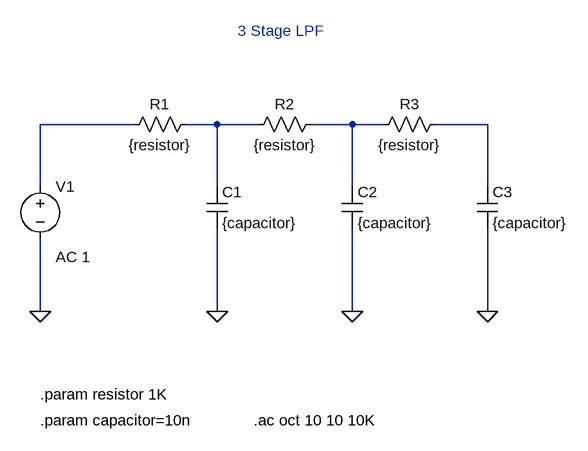
[diagram p0: schematic 6. Three Stage LPF using param.asc]
6. Three Stage LPF using param.asc, the LTspice schematic file:
Version 4
SHEET 1 880 680
WIRE 48 128 -96 128
WIRE 176 128 128 128
WIRE 240 128 176 128
WIRE 384 128 320 128
WIRE 432 128 384 128
WIRE 592 128 512 128
WIRE -96 224 -96 128
WIRE 176 224 176 128
WIRE 384 224 384 128
WIRE 592 224 592 128
WIRE -96 416 -96 304
WIRE 176 416 176 288
WIRE 384 416 384 288
WIRE 592 416 592 288
FLAG -96 416 0
FLAG 176 416 0
FLAG 384 416 0
FLAG 592 416 0
SYMBOL res 144 112 R90
WINDOW 0 0 56 VBottom 2
WINDOW 3 32 56 VTop 2
SYMATTR InstName R1
SYMATTR Value {resistor}
SYMBOL res 336 112 R90
WINDOW 0 0 56 VBottom 2
WINDOW 3 32 56 VTop 2
SYMATTR InstName R2
SYMATTR Value {resistor}
SYMBOL res 528 112 R90
WINDOW 0 0 56 VBottom 2
WINDOW 3 32 56 VTop 2
SYMATTR InstName R3
SYMATTR Value {resistor}
SYMBOL cap 160 224 R0
SYMATTR InstName C1
SYMATTR Value {capacitor}
SYMBOL cap 368 224 R0
SYMATTR InstName C2
SYMATTR Value {capacitor}
SYMBOL cap 576 224 R0
SYMATTR InstName C3
SYMATTR Value {capacitor}
SYMBOL voltage -96 208 R0
WINDOW 123 24 124 Left 2
WINDOW 39 0 0 Left 0
SYMATTR Value2 AC 1
SYMATTR InstName V1
SYMATTR Value ""
TEXT -96 544 Left 2 !.param resistor 1K
TEXT -96 584 Left 2 !.param capacitor=10n
TEXT 232 584 Left 2 !.ac oct 10 10 10K
TEXT 208 -16 Left 2 ;3 Stage LPF

The netlist it stands for:
* 6. Three Stage LPF using param.asc
R1 N002 N001 {resistor}
R2 N003 N002 {resistor}
R3 N004 N003 {resistor}
C1 N002 0 {capacitor}
C2 N003 0 {capacitor}
C3 N004 0 {capacitor}
V1 N001 0 AC 1
.param resistor 1K
.param capacitor=10n
.ac oct 10 10 10K
* 3 Stage LPF
.backanno
.end